# EAGLE schematic 18650_1S3P (EAGLE 9.4.2)
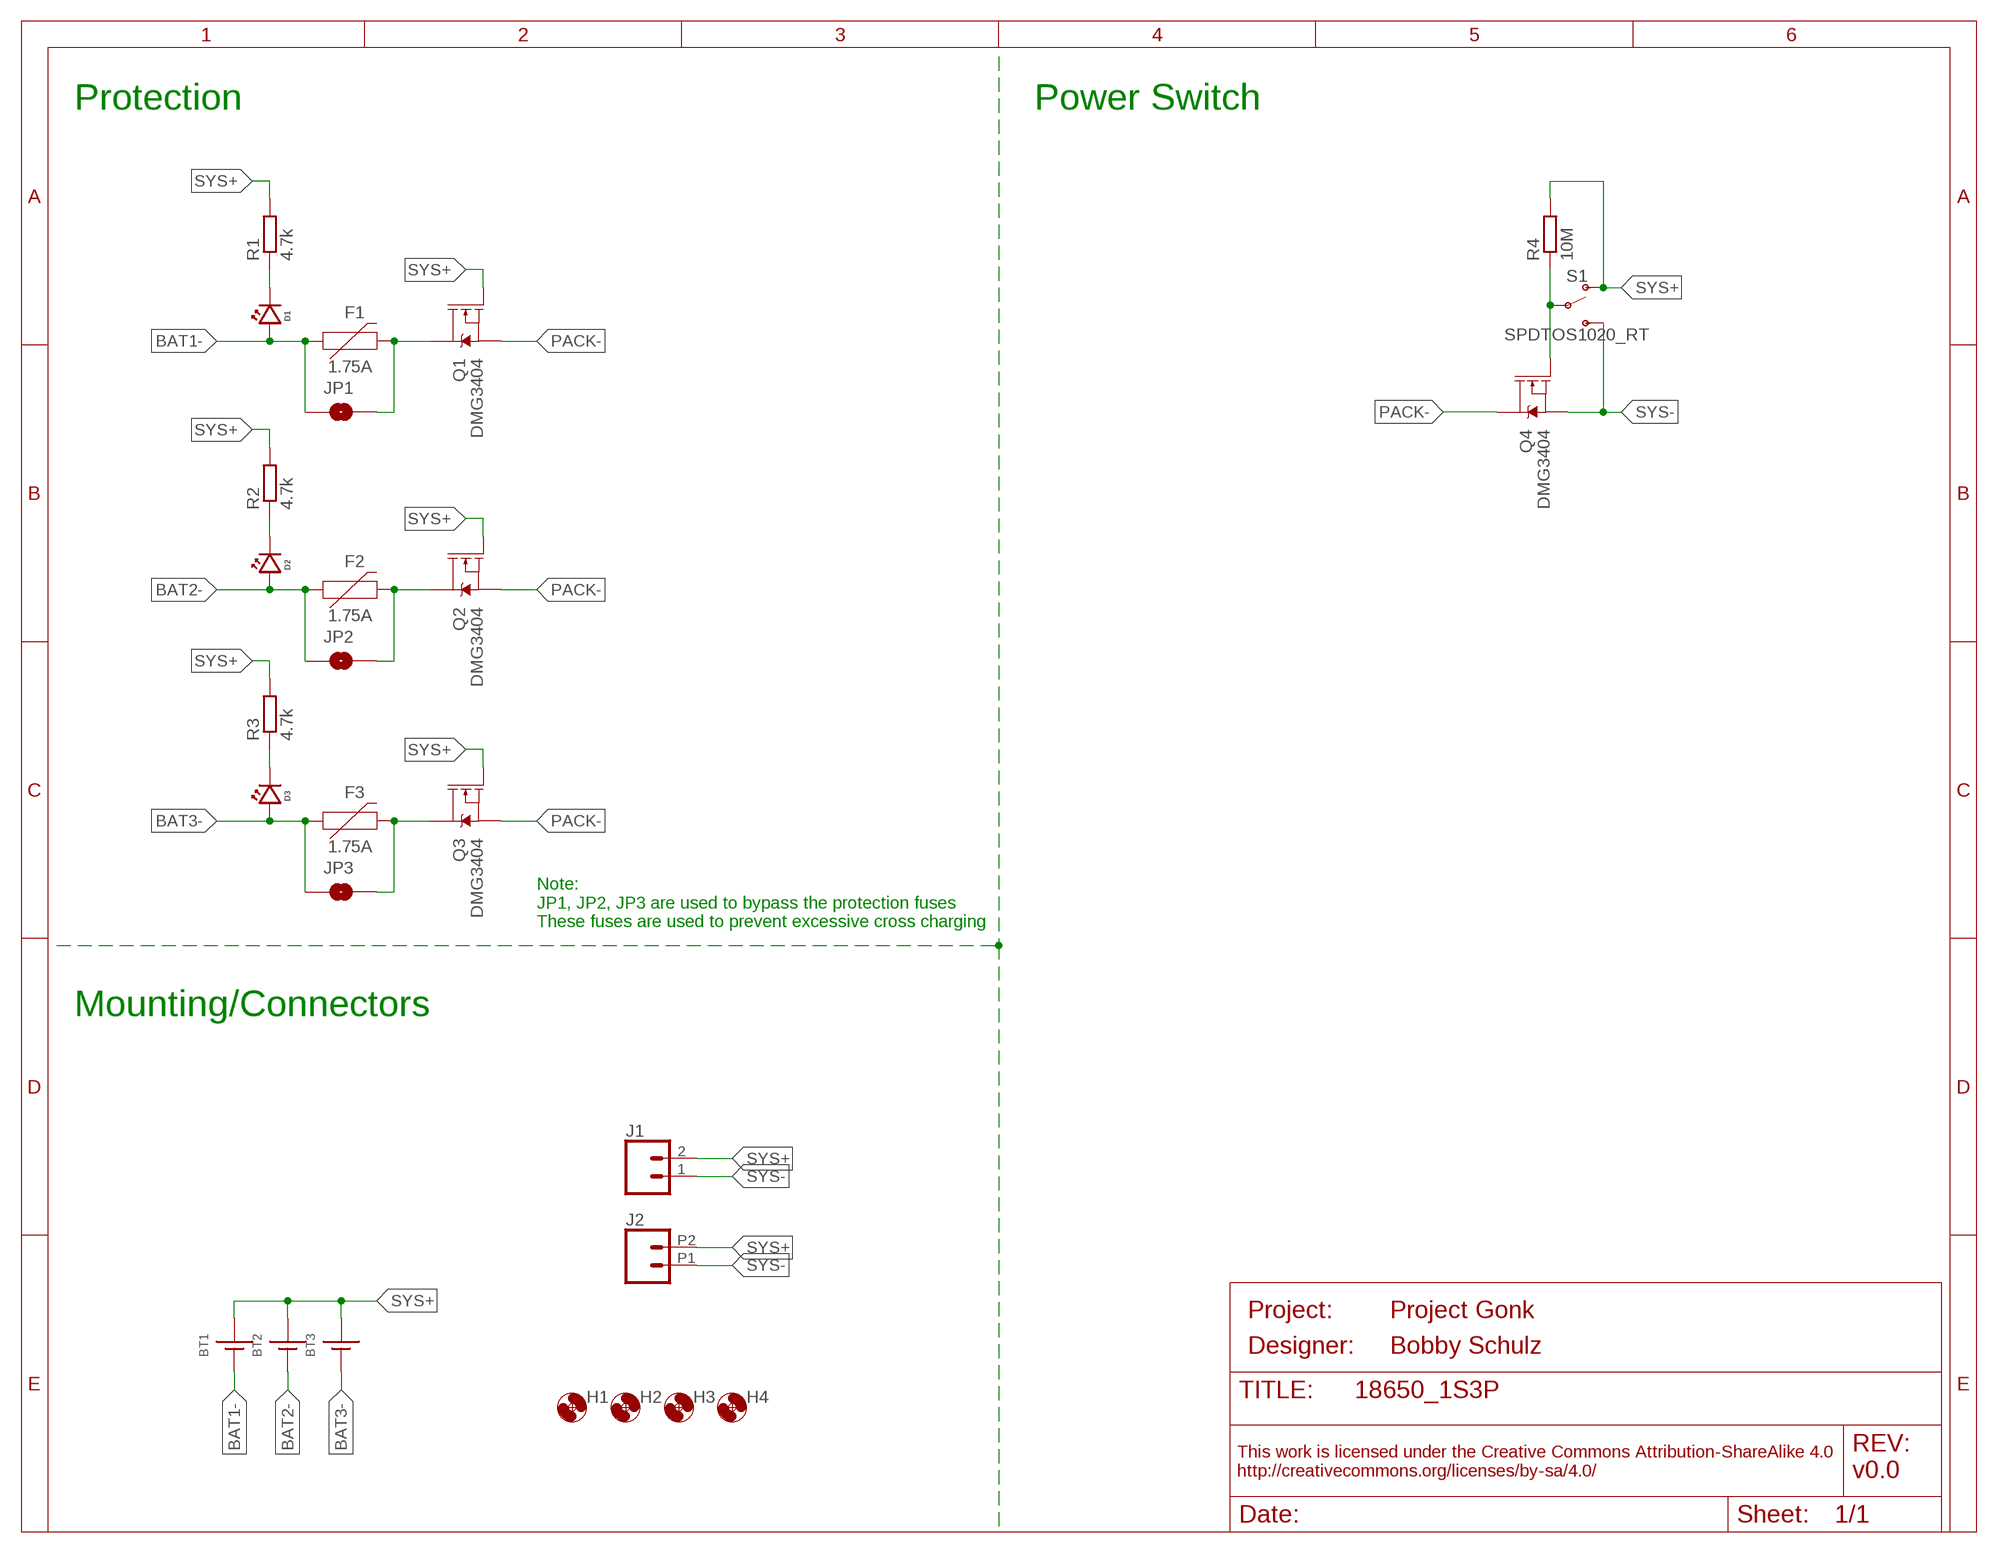
[diagram p0: schematic, sheet 1]
FRAME1 (FRAME_A_L): DESIGNER: Bobby Schulz; PROJECT: Project Gonk; REV: v0.0

## Parts
BT1  18650NO_PROTEC  [BATT_18650_CLIP]
BT2  18650NO_PROTEC  [BATT_18650_CLIP]
BT3  18650NO_PROTEC  [BATT_18650_CLIP]
D1  LED0805  [LED_0805]
D2  LED0805  [LED_0805]
D3  LED0805  [LED_0805]
F1  1.75A  PPTC1.75A1210  [1210_BOURNS]
F2  1.75A  PPTC1.75A1210  [1210_BOURNS]
F3  1.75A  PPTC1.75A1210  [1210_BOURNS]
H1  MOUNTING_HOLE4_NP  [4_40]
H2  MOUNTING_HOLE4_NP  [4_40]
H3  MOUNTING_HOLE4_NP  [4_40]
H4  MOUNTING_HOLE4_NP  [4_40]
J1  CONN_023.5MM_ROUND_RESTRICT  [SCREWTERMINAL-3.5MM-2_ROUND_RESTRICT]
J2  CONN_022.54_SCREW_ROUND  [1X02_2.54_SCREWTERM_ROUND]
JP1  JUMPER-SMT_2_NO_SILK  [SMT-JUMPER_2_NO_SILK]
JP2  JUMPER-SMT_2_NO_SILK  [SMT-JUMPER_2_NO_SILK]
JP3  JUMPER-SMT_2_NO_SILK  [SMT-JUMPER_2_NO_SILK]
Q1  DMG3404  MOSFET-NCH-DMG3404L  [SOT23-3]
Q2  DMG3404  MOSFET-NCH-DMG3404L  [SOT23-3]
Q3  DMG3404  MOSFET-NCH-DMG3404L  [SOT23-3]
Q4  DMG3404  MOSFET-NCH-DMG3404L  [SOT23-3]
R1  4.7k  R-EU_4.7KR0603  [R0603]
R2  4.7k  R-EU_4.7KR0603  [R0603]
R3  4.7k  R-EU_4.7KR0603  [R0603]
R4  10M  R-EU_10MR0603  [R0603]
S1  SPDTOS1020_RT  [OS102011MA1QN1]

## Nets
BAT1-: BT1.BATT-@1(-) BT1.BATT-@2(-) BT1.BATT-@3(-) D1.ANODE F1.1 JP1.1
BAT2-: BT2.BATT-@1(-) BT2.BATT-@2(-) BT2.BATT-@3(-) D2.ANODE F2.1 JP2.1
BAT3-: BT3.BATT-@1(-) BT3.BATT-@2(-) BT3.BATT-@3(-) D3.ANODE F3.1 JP3.1
N$1: D2.CATHODE R2.1
N$2: D1.CATHODE R1.1
N$3: F1.2 JP1.2 Q1.3(D)
N$4: F2.2 JP2.2 Q2.3(D)
N$5: D3.CATHODE R3.1
N$6: F3.2 JP3.2 Q3.3(D)
N$7: Q4.1(G) R4.1 S1.2(P)
PACK-: Q1.2(S) Q2.2(S) Q3.2(S) Q4.3(D)
SYS+: BT1.BATT+@1(+) BT1.BATT+@2(+) BT1.BATT+@3(+) BT2.BATT+@1(+) BT2.BATT+@2(+) BT2.BATT+@3(+) BT3.BATT+@1(+) BT3.BATT+@2(+) BT3.BATT+@3(+) J1.2 J2.P2 Q1.1(G) Q2.1(G) Q3.1(G) R1.2 R2.2 R3.2 R4.2 S1.1(O)
SYS-: J1.1 J2.P1 Q4.2(S) S1.3(S)

## Notes on the sheet
- Protection | Power Switch
- Note:
  JP1, JP2, JP3 are used to bypass the protection fuses
  These fuses are used to prevent excessive cross charging
- Mounting/Connectors

## Library data of the parts
BT1-BT3 = bschulz:18650: Battery Holder 18650 form factor Variant for with or without circuit protection (length varries depending on this); DIGIKEY: 36-54-ND; MF: Keystone; MPN: 54
D1-D3 = bschulz:LED: Genaric LED; DIGIKEY: 475-1278-1-ND; MF: OSRAM; MPN: LS R976-NR-1
F1-F3 = bschulz:PPTC: Bel Fuse PPTC; DIGIKEY: MF-USMF175X-2CT-ND; MF: Bourns; MPN: MF-USMF175X-2
H1-H4 = bschulz:MOUNTING_HOLE: Genaric Mechanical Mounting Hole Hole diameter based on max body diameter + 15% Keepout ring is for diameter of socket cap screw (minimum required clearance) TPlace ring is for diameter of pan head screw (recomended clearance) Specifications: Socket Cap <http://fastener-express.com/fastener-technical/SocketscapSS-Alloy.pdf> Button Head Socket Cap <http://fastener-express.com/fastener-technical/Button-Socket-alloy.pdf> Pan Head <http://fastener-express.com/fastener-technical/pan-machine-Screws.pdf>
J1 = bschulz:CONN_02: Genaric 2 terminal header SCREW_2.54 <https://www.digikey.com/product-detail/en/on-shore-technology-inc/OSTVN02A150/ED10561-ND/1588862> 39532_RA <https://www.digikey.com/product-detail/en/molex/0395321002/WM7845-ND/1280696>; DIGIKEY: ED2635-ND; MF: On Shore; MPN: OSTTE020161
J2 = bschulz:CONN_02: Genaric 2 terminal header SCREW_2.54 <https://www.digikey.com/product-detail/en/on-shore-technology-inc/OSTVN02A150/ED10561-ND/1588862> 39532_RA <https://www.digikey.com/product-detail/en/molex/0395321002/WM7845-ND/1280696>; DIGIKEY: ED10561-ND; MF: OnShore; MPN: OSTVN02A150
JP1-JP3 = SparkFun-Jumpers:JUMPER-SMT_2_NO: Normally open jumper This jumper has two pads in close proximity to each other. Apply solder to close the connection. Round pads are easier to solder for beginners, but are a lot larger. SparkFun Product that uses the round pads: SparkFun EL Sequencer <https://www.sparkfun.com/products/12781>
Q1-Q4 = bschulz:MOSFET-NCH: N-channel MOSFETs Voltage controlled devices that allow control of high current outputs. SparkFun Products: SparkFun OpenScale <https://www.sparkfun.com/products/13261> SparkFun Digital Sandbox <https://www.sparkfun.com/products/12651> SparkFun Monster Moto Shield <https://www.sparkfun.com/products/10182> SparkFun MOSFET Power Controller <https://www.sparkfun.com/products/11214>; DIGIKEY: DMG3404L-7DICT-ND; MF: Diodes Incorporated; MPN: DMG3404L-7
R1-R3 = bschulz_passives:R-EU_: RESISTOR, European symbol Digikey Parts: Yageo, 0402 <https://www.digikey.com/products/en/resistors/chip-resistor-surface-mount/52?k=&pkeyword=&sv=0&s=4356&sf=1&FV=-1%7C13%2C7%7C2%2C1291%7C39157%2C1989%7C0%2C-8%7C52%2C3%7C1131%2C3%7C2503&quantity=&ColumnSort=0&page=1&stock=1&pageSize=25> Yageo, 0603 <https://www.digikey.com/products/en/resistors/chip-resistor-surface-mount/52?k=&pkeyword=&sv=0&pv1291=39245&sf=1&FV=-5%7C4356%2C-5%7C47360%2C-8%7C52%2C-1%7C13%2C7%7C2%2C1989%7C0&quantity=10&ColumnSort=1000011&page=1&stock=1&pageSize=25> Panasonic, 0603 <https://www.digikey.com/products/en/resistors/chip-resistor-surface-mount/52?k=&pkeyword=&pv252=68&sf=0&FV=ffec373d%2C1c0002%2C142c040c%2C1f140000%2Cffe00034%2C80002%2Cc0001&quantity=&ColumnSort=0&page=1&stock=1&pageSize=25> Panasonic, precision, 0603 <https://www.digikey.com/products/en/resistors/chip-resistor-surface-mount/52?FV=ffec4907%2Cfffc000a%2Cc0172%2C142c040c%2C1f140000%2Cffe00034%2C1c0002&quantity=100&ColumnSort=2085&page=1&stock=1&pageSize=25> Panasonic, 0805 <https://www.digikey.com/products/en/resistors/chip-resistor-surface-mount/52?k=&pkeyword=&pv3=1&sf=0&FV=ffec373d%2C1c0002%2C1f140000%2Cffe00034%2C142c040d&quantity=&ColumnSort=0&page=1&stock=1&pageSize=25> Rohm, current sense <https://www.digikey.com/products/en/resistors/chip-resistor-surface-mount/52?k=&pkeyword=&pv3=1&sf=0&FV=ffecb688%2C1f140000%2Cffe00034%2C1c0002&quantity=&ColumnSort=0&page=1&stock=1&pageSize=25> Vishay, pulse proof automotive <https://www.digikey.com/products/en/resistors/chip-resistor-surface-mount/52?k=&pkeyword=&pv7=2&sf=0&FV=ffec5d6b%2Cffe00034%2C1f140000&quantity=&ColumnSort=0&page=1&stock=1&pageSize=25>; DIGIKEY: 311-4.70KHRCT-ND; MF: Yageo; MPN: RC0603FR-074K7L; VALUE_PART: 4.7k
R4 = bschulz_passives:R-EU_: RESISTOR, European symbol Digikey Parts: Yageo, 0402 <https://www.digikey.com/products/en/resistors/chip-resistor-surface-mount/52?k=&pkeyword=&sv=0&s=4356&sf=1&FV=-1%7C13%2C7%7C2%2C1291%7C39157%2C1989%7C0%2C-8%7C52%2C3%7C1131%2C3%7C2503&quantity=&ColumnSort=0&page=1&stock=1&pageSize=25> Yageo, 0603 <https://www.digikey.com/products/en/resistors/chip-resistor-surface-mount/52?k=&pkeyword=&sv=0&pv1291=39245&sf=1&FV=-5%7C4356%2C-5%7C47360%2C-8%7C52%2C-1%7C13%2C7%7C2%2C1989%7C0&quantity=10&ColumnSort=1000011&page=1&stock=1&pageSize=25> Panasonic, 0603 <https://www.digikey.com/products/en/resistors/chip-resistor-surface-mount/52?k=&pkeyword=&pv252=68&sf=0&FV=ffec373d%2C1c0002%2C142c040c%2C1f140000%2Cffe00034%2C80002%2Cc0001&quantity=&ColumnSort=0&page=1&stock=1&pageSize=25> Panasonic, precision, 0603 <https://www.digikey.com/products/en/resistors/chip-resistor-surface-mount/52?FV=ffec4907%2Cfffc000a%2Cc0172%2C142c040c%2C1f140000%2Cffe00034%2C1c0002&quantity=100&ColumnSort=2085&page=1&stock=1&pageSize=25> Panasonic, 0805 <https://www.digikey.com/products/en/resistors/chip-resistor-surface-mount/52?k=&pkeyword=&pv3=1&sf=0&FV=ffec373d%2C1c0002%2C1f140000%2Cffe00034%2C142c040d&quantity=&ColumnSort=0&page=1&stock=1&pageSize=25> Rohm, current sense <https://www.digikey.com/products/en/resistors/chip-resistor-surface-mount/52?k=&pkeyword=&pv3=1&sf=0&FV=ffecb688%2C1f140000%2Cffe00034%2C1c0002&quantity=&ColumnSort=0&page=1&stock=1&pageSize=25> Vishay, pulse proof automotive <https://www.digikey.com/products/en/resistors/chip-resistor-surface-mount/52?k=&pkeyword=&pv7=2&sf=0&FV=ffec5d6b%2Cffe00034%2C1f140000&quantity=&ColumnSort=0&page=1&stock=1&pageSize=25>; DIGIKEY: RMCF0603FT10M0CT-ND; MF: Stackpole; MPN: RMCF0603FT10M0; VALUE_PART: 10M
S1 = bschulz:SPDT: Genaric SPDT switch; DIGIKEY: CKN9559-ND; MF: C&K; MPN: OS102011MA1QN1